# Altium schematic sheet 7.HDMI2.SchDoc
size 297 x 209 mm; SheetNumber: 7; SheetTotal: 13
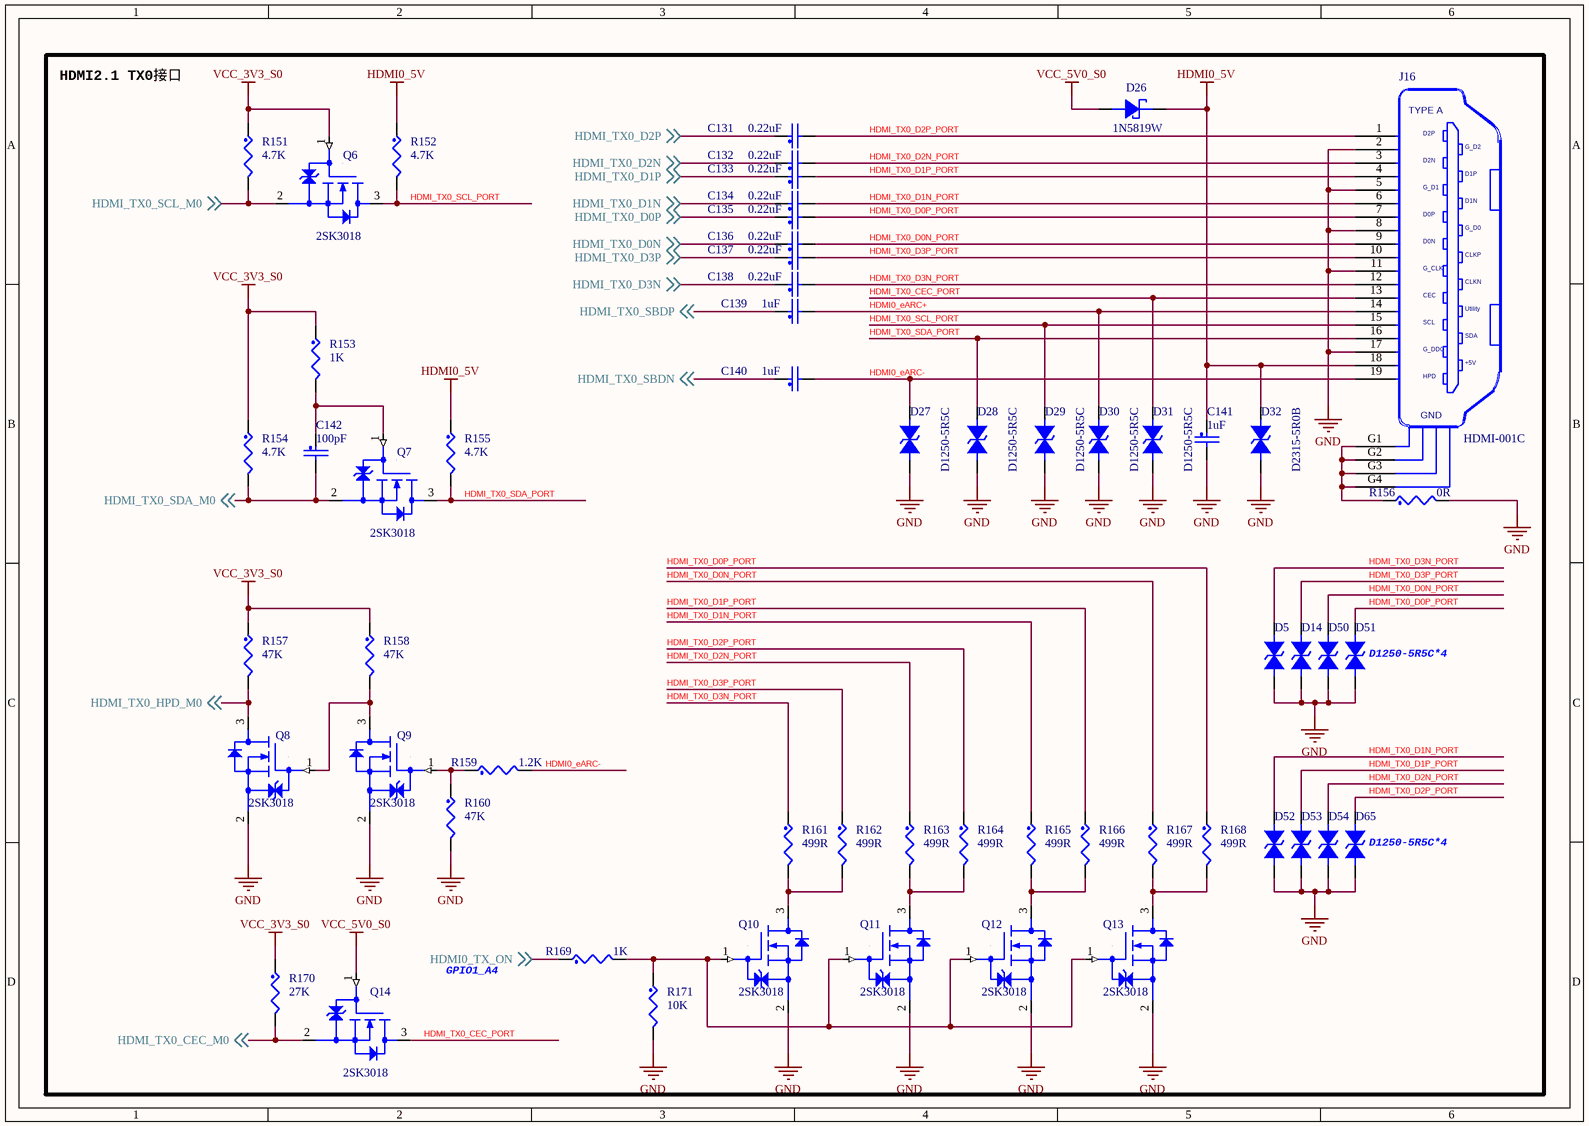
[diagram p0: 7.HDMI2.SchDoc]

## Parts
C131  0.22uF  [C0402]
C132  0.22uF  [C0402]
C133  0.22uF  [C0402]
C134  0.22uF  [C0402]
C135  0.22uF  [C0402]
C136  0.22uF  [C0402]
C137  0.22uF  [C0402]
C138  0.22uF  [C0402]
C139  1uF  [C0402]
C140  1uF  [C0402]
C141  1uF  [C0402]
C142  100pF  [C0402]
D5  D1250-5R5C  [esd0402]  (value not drawn)
D14  D1250-5R5C  [esd0402]  (value not drawn)
D26  1N5819W  [SOD-123]
D27  D1250-5R5C  [esd0402]
D28  D1250-5R5C  [esd0402]
D29  D1250-5R5C  [esd0402]
D30  D1250-5R5C  [esd0402]
D31  D1250-5R5C  [esd0402]
D32  D2315-5R0B  [esd0402]
D50  D1250-5R5C  [esd0402]  (value not drawn)
D51  D1250-5R5C  [esd0402]  (value not drawn)
D52  D1250-5R5C  [esd0402]  (value not drawn)
D53  D1250-5R5C  [esd0402]  (value not drawn)
D54  D1250-5R5C  [esd0402]  (value not drawn)
D65  D1250-5R5C  [esd0402]  (value not drawn)
J16  HDMI-001C  [HDMI-SMD]
Q6  2SK3018  [SOT23]
Q7  2SK3018  [SOT23]
Q8  2SK3018  [SOT23]
Q9  2SK3018  [SOT23]
Q10  2SK3018  [SOT23]
Q11  2SK3018  [SOT23]
Q12  2SK3018  [SOT23]
Q13  2SK3018  [SOT23]
Q14  2SK3018  [SOT23]
R151  4.7K  [R0402]
R152  4.7K  [R0402]
R153  1K  [R0402]
R154  4.7K  [R0402]
R155  4.7K  [R0402]
R156  0R  [R0402]
R157  47K  [R0402]
R158  47K  [R0402]
R159  1.2K  [R0402]
R160  47K  [R0402]
R161  499R  [R0402]
R162  499R  [R0402]
R163  499R  [R0402]
R164  499R  [R0402]
R165  499R  [R0402]
R166  499R  [R0402]
R167  499R  [R0402]
R168  499R  [R0402]
R169  1K  [R0402]
R170  27K  [R0402]
R171  10K  [R0402]

## Nets
GND: C141.2 D5.1 D14.1 D27.1 D28.1 D29.1 D30.1 D31.1 D32.1 D50.1 D51.1 D52.1 D53.1 D54.1 D65.1 J16.2 J16.5 J16.8 J16.11 J16.17 Q8.2(SOURCE) Q9.2(SOURCE) Q10.2(SOURCE) Q11.2(SOURCE) Q12.2(SOURCE) Q13.2(SOURCE) R156.2 R160.2 R171.2
HDMI0_5V: C141.1 D26.1 D32.2 J16.18 R152.1 R155.1
VCC_3V3_S0: Q6.1(GATE) R151.1 R153.1 R154.1 R157.1 R158.1 R170.1
VCC_5V0_S0: D26.2 Q14.1(GATE)
HDMI0_eARC+: C139.2 D30.2 J16.14
HDMI0_eARC-: C140.2 D27.2 J16.19 R159.2
HDMI0_TX_ON: R169.1 ; off-sheet HDMI0_TX_ON
HDMI_TX0_CEC_M0: Q14.2(SOURCE) R170.2 ; off-sheet HDMI_TX0_CEC_M0
HDMI_TX0_CEC_PORT: D31.2 J16.13 Q14.3(DRAIN)
HDMI_TX0_D0N: C136.1 ; off-sheet HDMI_TX0_D0N
HDMI_TX0_D0N_PORT: C136.2 D50.2 J16.9 R167.1
HDMI_TX0_D0P: C135.1 ; off-sheet HDMI_TX0_D0P
HDMI_TX0_D0P_PORT: C135.2 D51.2 J16.7 R168.1
HDMI_TX0_D1N: C134.1 ; off-sheet HDMI_TX0_D1N
HDMI_TX0_D1N_PORT: C134.2 D52.2 J16.6 R165.1
HDMI_TX0_D1P: C133.1 ; off-sheet HDMI_TX0_D1P
HDMI_TX0_D1P_PORT: C133.2 D53.2 J16.4 R166.1
HDMI_TX0_D2N: C132.1 ; off-sheet HDMI_TX0_D2N
HDMI_TX0_D2N_PORT: C132.2 D54.2 J16.3 R163.1
HDMI_TX0_D2P: C131.1 ; off-sheet HDMI_TX0_D2P
HDMI_TX0_D2P_PORT: C131.2 D65.2 J16.1 R164.1
HDMI_TX0_D3N: C138.1 ; off-sheet HDMI_TX0_D3N
HDMI_TX0_D3N_PORT: C138.2 D5.2 J16.12 R161.1
HDMI_TX0_D3P: C137.1 ; off-sheet HDMI_TX0_D3P
HDMI_TX0_D3P_PORT: C137.2 D14.2 J16.10 R162.1
HDMI_TX0_HPD_M0: Q8.3(DRAIN) R157.2 ; off-sheet HDMI_TX0_HPD_M0
HDMI_TX0_SBDN: C140.1 ; off-sheet HDMI_TX0_SBDN
HDMI_TX0_SBDP: C139.1 ; off-sheet HDMI_TX0_SBDP
HDMI_TX0_SCL_M0: Q6.2(SOURCE) R151.2 ; off-sheet HDMI_TX0_SCL_M0
HDMI_TX0_SCL_PORT: D29.2 J16.15 Q6.3(DRAIN) R152.2
HDMI_TX0_SDA_M0: C142.2 Q7.2(SOURCE) R154.2 ; off-sheet HDMI_TX0_SDA_M0
HDMI_TX0_SDA_PORT: D28.2 J16.16 Q7.3(DRAIN) R155.2
NetC142_1: C142.1 Q7.1(GATE) R153.2
NetJ16_G1: J16.G1 J16.G2 J16.G3 J16.G4 R156.1
NetQ8_1: Q8.1(GATE) Q9.3(DRAIN) R158.2
NetQ9_1: Q9.1(GATE) R159.1 R160.1
NetQ10_1: Q10.1(GATE) Q11.1(GATE) Q12.1(GATE) Q13.1(GATE) R169.2 R171.1
NetQ10_3: Q10.3(DRAIN) R161.2 R162.2
NetQ11_3: Q11.3(DRAIN) R163.2 R164.2
NetQ12_3: Q12.3(DRAIN) R165.2 R166.2
NetQ13_3: Q13.3(DRAIN) R167.2 R168.2

## Notes on the sheet
- HDMI2.1 TX0接口
- (near D51) D1250-5R5C*4
- (near D65) D1250-5R5C*4
- (near Q14) GPIO1_A4
- (in symbol HDMI-001C) TYPE A; D2P; G_D2; D2N; D1P; G_D1; D1N; D0P; G_D0; D0N; CLKP; G_CLK; CLKN; CEC; Utility; SCL; SDA; G_DDC; +5V; HPD; GND

## Library data of the parts
C131-C142 = CAP_NP
D5 D14 D27-D32 D50-D54 D65 = DIODE BI-DIR TRIG
D26 = DIODE_SCHTKY
R151-R171 = RES